# Altium schematic sheet 00-ARCHITECTURE.SchDoc
size A4
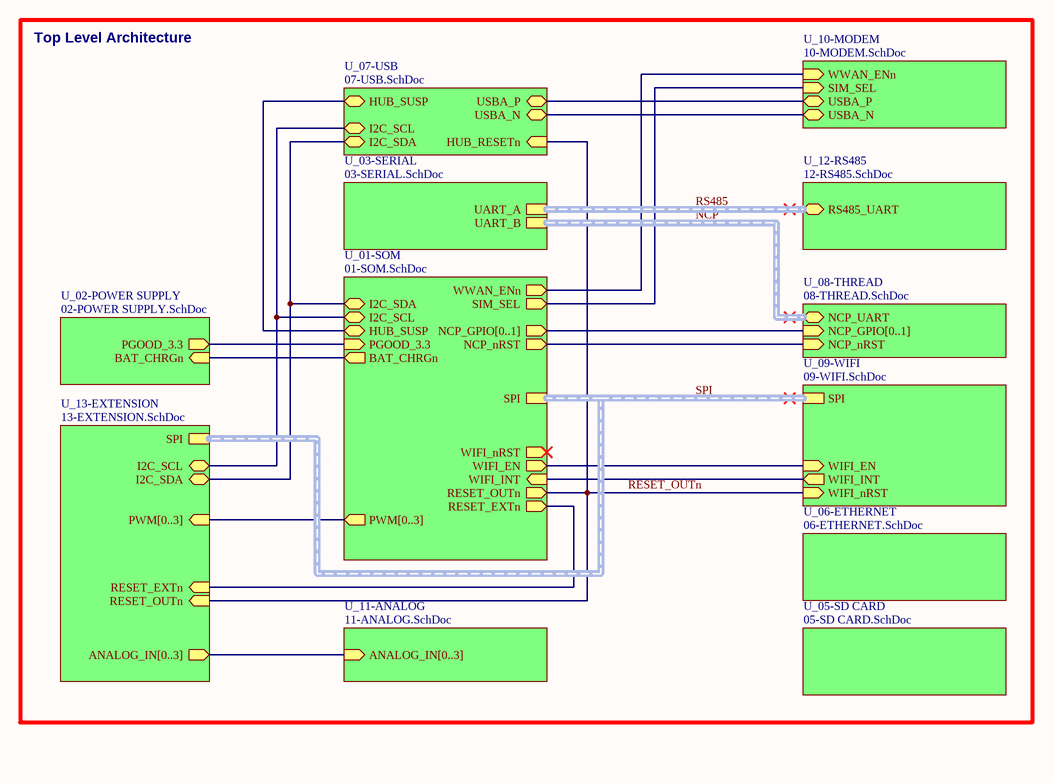
[diagram p0: 00-ARCHITECTURE.SchDoc]

## Sub-sheets
U_01-SOM = 01-SOM.SchDoc: PWM[0..3] (out), RESET_OUTn (out), WIFI_nRST (out), WIFI_INT (in), WWAN_ENn (out), SIM_SEL (out), NCP_nRST (out), WIFI_EN (out), SPI (harness SPI), NCP_GPIO[0..1] (out), I2C_SDA (bidir), I2C_SCL (bidir), RESET_EXTn (out), HUB_SUSP (bidir), BAT_CHRGn (out), PGOOD_3.3 (in)
U_02-POWER SUPPLY = 02-POWER SUPPLY.SchDoc: PGOOD_3.3 (out), BAT_CHRGn (in)
U_03-SERIAL = 03-SERIAL.SchDoc: UART_A (harness UART), UART_B (harness UART)
U_05-SD CARD = 05-SD CARD.SchDoc: no entries
U_06-ETHERNET = 06-ETHERNET.SchDoc: no entries
U_07-USB = 07-USB.SchDoc: USBA_P (bidir), USBA_N (bidir), HUB_SUSP (bidir), HUB_RESETn (in), I2C_SDA (bidir), I2C_SCL (bidir)
U_08-THREAD = 08-THREAD.SchDoc: NCP_GPIO[0..1] (in), NCP_nRST (in), NCP_UART (bidir, harness UART)
U_09-WIFI = 09-WIFI.SchDoc: WIFI_nRST (in), WIFI_INT (out), WIFI_EN (in), SPI (harness SPI)
U_10-MODEM = 10-MODEM.SchDoc: USBA_P (bidir), USBA_N (bidir), SIM_SEL (in), WWAN_ENn (in)
U_11-ANALOG = 11-ANALOG.SchDoc: ANALOG_IN[0..3] (in)
U_12-RS485 = 12-RS485.SchDoc: RS485_UART (bidir, harness UART)
U_13-EXTENSION = 13-EXTENSION.SchDoc: RESET_OUTn (in), SPI (harness SPI), I2C_SDA (bidir), PWM[0..3] (in), RESET_EXTn (in), I2C_SCL (bidir), ANALOG_IN[0..3] (out)

## Nets
RESET_OUTn: sheet U_07-USB/HUB_RESETn, sheet U_09-WIFI/WIFI_nRST, sheet U_01-SOM/RESET_OUTn, sheet U_13-EXTENSION/RESET_OUTn
(unnamed): sheet U_07-USB/USBA_P, sheet U_10-MODEM/USBA_P
(unnamed): sheet U_07-USB/USBA_N, sheet U_10-MODEM/USBA_N
(unnamed): sheet U_07-USB/HUB_SUSP, sheet U_01-SOM/HUB_SUSP
(unnamed): sheet U_07-USB/I2C_SDA, sheet U_01-SOM/I2C_SDA, sheet U_13-EXTENSION/I2C_SDA
(unnamed): sheet U_07-USB/I2C_SCL, sheet U_01-SOM/I2C_SCL, sheet U_13-EXTENSION/I2C_SCL
(unnamed): sheet U_02-POWER SUPPLY/PGOOD_3.3, sheet U_01-SOM/PGOOD_3.3
(unnamed): sheet U_02-POWER SUPPLY/BAT_CHRGn, sheet U_01-SOM/BAT_CHRGn
(unnamed): sheet U_08-THREAD/NCP_nRST, sheet U_01-SOM/NCP_nRST
(unnamed): sheet U_09-WIFI/WIFI_INT, sheet U_01-SOM/WIFI_INT
(unnamed): sheet U_09-WIFI/WIFI_EN, sheet U_01-SOM/WIFI_EN
(unnamed): sheet U_10-MODEM/SIM_SEL, sheet U_01-SOM/SIM_SEL
(unnamed): sheet U_10-MODEM/WWAN_ENn, sheet U_01-SOM/WWAN_ENn
(unnamed): sheet U_01-SOM/RESET_EXTn, sheet U_13-EXTENSION/RESET_EXTn

## Buses and harness runs
bus sheet U_01-SOM/NCP_GPIO[0..1] = sheet U_08-THREAD/NCP_GPIO[0..1]
bus sheet U_01-SOM/PWM[0..3] = sheet U_13-EXTENSION/PWM[0..3]
bus sheet U_11-ANALOG/ANALOG_IN[0..3] = sheet U_13-EXTENSION/ANALOG_IN[0..3]
harness NCP = sheet U_03-SERIAL/UART_B = sheet U_08-THREAD/NCP_UART
harness RS485 = sheet U_03-SERIAL/UART_A = sheet U_12-RS485/RS485_UART
harness SPI = sheet U_01-SOM/SPI = sheet U_09-WIFI/SPI = sheet U_13-EXTENSION/SPI

## Notes on the sheet
- Top Level Architecture